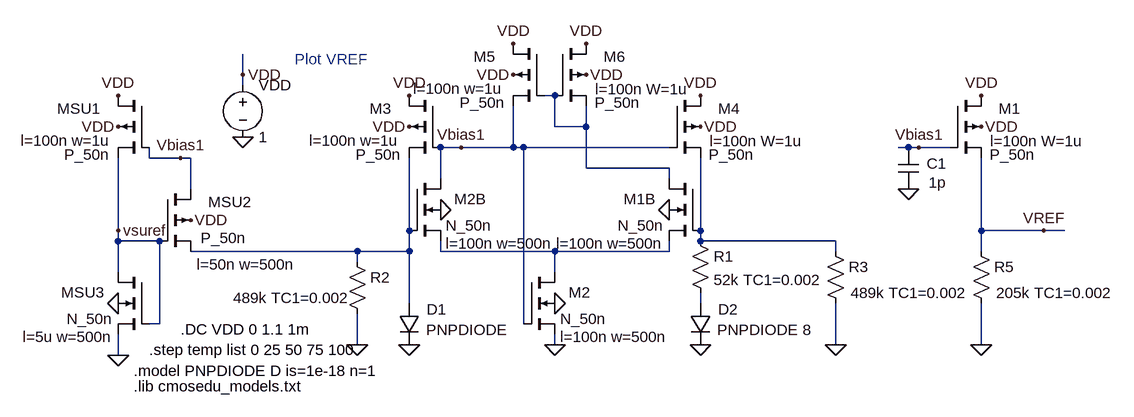
[diagram p0: schematic Fig23_31.asc]
Fig23_31.asc, the LTspice schematic file:
Version 4
SHEET 1 3140 680
WIRE 1424 -336 1424 -448
WIRE 1424 -320 1424 -336
WIRE 1424 -272 1424 -320
WIRE 1424 -144 1424 -176
WIRE 1472 -448 1472 -464
WIRE 1488 -320 1424 -320
WIRE 1488 -192 1472 -192
WIRE 1488 -192 1488 -320
WIRE 1520 -448 1472 -448
WIRE 1536 -448 1520 -448
WIRE 1536 -400 1536 -448
WIRE 1616 -576 1616 -608
WIRE 1616 -560 1616 -576
WIRE 1792 -304 1536 -304
WIRE 1792 -288 1792 -304
WIRE 1792 -160 1792 -208
WIRE 1872 -336 1872 -448
WIRE 1872 -304 1792 -304
WIRE 1872 -304 1872 -336
WIRE 1872 -224 1872 -304
WIRE 1920 -416 1920 -464
WIRE 1920 -304 1920 -320
WIRE 1952 -464 1920 -464
WIRE 2032 -464 1952 -464
WIRE 2032 -464 2032 -528
WIRE 2048 -464 2032 -464
WIRE 2048 -192 2048 -464
WIRE 2096 -544 2080 -544
WIRE 2096 -496 2096 -544
WIRE 2096 -304 1920 -304
WIRE 2096 -272 2096 -304
WIRE 2096 -160 2096 -176
WIRE 2144 -496 2096 -496
WIRE 2144 -496 2144 -528
WIRE 2144 -432 2144 -496
WIRE 2272 -464 2048 -464
WIRE 2272 -432 2144 -432
WIRE 2272 -416 2272 -432
WIRE 2272 -304 2096 -304
WIRE 2272 -304 2272 -320
WIRE 2320 -336 2320 -448
WIRE 2320 -320 2320 -336
WIRE 2320 -224 2320 -240
WIRE 2528 -320 2320 -320
WIRE 2528 -304 2528 -320
WIRE 2528 -160 2528 -224
WIRE 2640 -464 2624 -464
WIRE 2656 -464 2640 -464
WIRE 2704 -464 2656 -464
WIRE 2752 -336 2752 -448
WIRE 2752 -304 2752 -336
WIRE 2752 -160 2752 -224
WIRE 2848 -336 2752 -336
WIRE 2880 -336 2848 -336
FLAG 1616 -480 0
FLAG 1616 -576 VDD
FLAG 1424 -224 0
FLAG 1424 -144 0
FLAG 1424 -496 VDD
FLAG 1424 -544 VDD
FLAG 1872 -496 VDD
FLAG 1872 -544 VDD
FLAG 2320 -496 VDD
FLAG 2320 -544 VDD
FLAG 1920 -368 0
FLAG 2272 -368 0
FLAG 1872 -160 0
FLAG 1536 -352 VDD
FLAG 1424 -336 vsuref
FLAG 1952 -464 Vbias1
FLAG 1520 -448 Vbias1
FLAG 2320 -160 0
FLAG 1792 -160 0
FLAG 2528 -160 0
FLAG 2752 -496 VDD
FLAG 2752 -544 VDD
FLAG 2752 -160 0
FLAG 2848 -336 VREF
FLAG 2656 -464 Vbias1
FLAG 2640 -400 0
FLAG 2096 -224 0
FLAG 2032 -576 VDD
FLAG 2032 -624 VDD
FLAG 2144 -576 VDD
FLAG 2144 -624 VDD
FLAG 2096 -160 0
SYMBOL voltage 1616 -576 R0
WINDOW 123 0 0 Left 0
WINDOW 39 0 0 Left 0
SYMATTR InstName VDD
SYMATTR Value 1
SYMBOL nmos4 1472 -272 M0
WINDOW 123 56 100 Left 0
WINDOW 0 69 31 Left 0
SYMATTR Value2 l=5u w=500n
SYMATTR InstName MSU3
SYMATTR Value N_50n
SYMBOL pmos4 1472 -544 M0
WINDOW 0 75 20 Left 0
WINDOW 3 61 91 Left 0
WINDOW 123 59 69 Left 0
SYMATTR InstName MSU1
SYMATTR Value P_50n
SYMATTR Value2 l=100n w=1u
SYMBOL pmos4 1920 -544 M0
WINDOW 0 75 20 Left 0
WINDOW 3 61 91 Left 0
WINDOW 123 63 69 Left 0
SYMATTR InstName M3
SYMATTR Value P_50n
SYMATTR Value2 l=100n w=1u
SYMBOL pmos4 2272 -544 R0
WINDOW 0 75 20 Left 0
WINDOW 3 61 91 Left 0
WINDOW 123 62 70 Left 0
SYMATTR InstName M4
SYMATTR Value P_50n
SYMATTR Value2 l=100n W=1u
SYMBOL nmos4 1872 -416 R0
WINDOW 123 56 100 Left 0
WINDOW 0 69 31 Left 0
SYMATTR Value2 l=100n w=500n
SYMATTR InstName M2B
SYMATTR Value N_50n
SYMBOL nmos4 2320 -416 M0
WINDOW 123 56 100 Left 0
WINDOW 0 69 31 Left 0
SYMATTR Value2 l=100n w=500n
SYMATTR InstName M1B
SYMATTR Value N_50n
SYMBOL res 2304 -336 R0
SYMATTR InstName R1
SYMATTR Value 52k TC1=0.002
SYMBOL diode 1856 -224 R0
WINDOW 0 43 9 Left 0
WINDOW 3 42 41 Left 0
SYMATTR InstName D1
SYMATTR Value PNPDIODE
SYMBOL pmos4 1488 -400 R0
WINDOW 0 75 20 Left 0
WINDOW 3 63 75 Left 0
WINDOW 123 57 116 Left 0
SYMATTR InstName MSU2
SYMATTR Value P_50n
SYMATTR Value2 l=50n w=500n
SYMBOL diode 2304 -224 R0
WINDOW 0 43 9 Left 0
WINDOW 3 42 41 Left 0
SYMATTR InstName D2
SYMATTR Value PNPDIODE 8
SYMBOL res 1776 -304 R0
WINDOW 3 -175 72 Left 0
SYMATTR Value 489k TC1=0.002
SYMATTR InstName R2
SYMBOL res 2512 -320 R0
WINDOW 3 39 80 Left 0
SYMATTR Value 489k TC1=0.002
SYMATTR InstName R3
SYMBOL pmos4 2704 -544 R0
WINDOW 0 75 20 Left 0
WINDOW 3 61 91 Left 0
WINDOW 123 62 70 Left 0
SYMATTR InstName M1
SYMATTR Value P_50n
SYMATTR Value2 l=100n W=1u
SYMBOL res 2736 -320 R0
WINDOW 3 39 80 Left 0
SYMATTR Value 205k TC1=0.002
SYMATTR InstName R5
SYMBOL cap 2624 -464 R0
WINDOW 0 44 25 Left 0
WINDOW 3 47 54 Left 0
SYMATTR InstName C1
SYMATTR Value 1p
SYMBOL nmos4 2048 -272 R0
WINDOW 123 56 100 Left 0
WINDOW 0 69 31 Left 0
SYMATTR Value2 l=100n w=500n
SYMATTR InstName M2
SYMATTR Value N_50n
SYMBOL pmos4 2080 -624 M0
WINDOW 0 75 20 Left 0
WINDOW 3 61 91 Left 0
WINDOW 123 63 69 Left 0
SYMATTR InstName M5
SYMATTR Value P_50n
SYMATTR Value2 l=100n w=1u
SYMBOL pmos4 2096 -624 R0
WINDOW 0 75 20 Left 0
WINDOW 3 61 91 Left 0
WINDOW 123 62 70 Left 0
SYMATTR InstName M6
SYMATTR Value P_50n
SYMATTR Value2 l=100n W=1u
TEXT 1448 -96 Left 0 !.lib cmosedu_models.txt
TEXT 1696 -600 Left 0 ;Plot VREF
TEXT 1520 -184 Left 0 !.DC VDD 0 1.1 1m
TEXT 1472 -152 Left 0 !.step temp list 0 25 50 75 100
TEXT 1448 -120 Left 0 !.model PNPDIODE D is=1e-18 n=1

The netlist it stands for:
* Fig23_31.asc
VDD VDD 0 1
MSU3 vsuref vsuref 0 0 N_50n l=5u w=500n
MSU1 VDD Vbias1 vsuref VDD P_50n l=100n w=1u
M3 VDD Vbias1 N001 VDD P_50n l=100n w=1u
M4 VDD Vbias1 N004 VDD P_50n l=100n W=1u
M2B Vbias1 N001 N002 0 N_50n l=100n w=500n
M1B N003 N004 N002 0 N_50n l=100n w=500n
R1 N004 N005 52k TC1=0.002
D1 N001 0 PNPDIODE
MSU2 Vbias1 vsuref N001 VDD P_50n l=50n w=500n
D2 N005 0 PNPDIODE 8
R2 N001 0 489k TC1=0.002
R3 N004 0 489k TC1=0.002
M1 VDD Vbias1 VREF VDD P_50n l=100n W=1u
R5 VREF 0 205k TC1=0.002
C1 Vbias1 0 1p
M2 N002 Vbias1 0 0 N_50n l=100n w=500n
M5 VDD N003 Vbias1 VDD P_50n l=100n w=1u
M6 VDD N003 N003 VDD P_50n l=100n W=1u
.model D D
.lib standard.dio
.model NMOS NMOS
.model PMOS PMOS
.lib standard.mos
.lib cmosedu_models.txt
* Plot VREF
.DC VDD 0 1.1 1m
.step temp list 0 25 50 75 100
.model PNPDIODE D is=1e-18 n=1
.backanno
.end